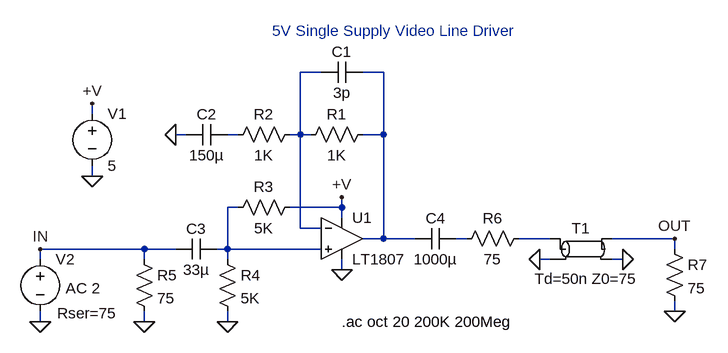
[diagram p0: schematic 1807.asc]
1807.asc, the LTspice schematic file:
Version 4
SHEET 1 896 680
WIRE 160 -16 128 -16
WIRE 256 -16 224 -16
WIRE -192 48 -192 32
WIRE -48 80 -64 80
WIRE 32 80 16 80
WIRE 128 80 128 -16
WIRE 128 80 112 80
WIRE 144 80 128 80
WIRE 256 80 256 -16
WIRE 256 80 224 80
WIRE -192 144 -192 128
WIRE 32 192 16 192
WIRE 192 192 192 176
WIRE 192 192 112 192
WIRE 192 208 192 192
WIRE 128 224 128 80
WIRE 160 224 128 224
WIRE 256 240 256 80
WIRE 256 240 224 240
WIRE 304 240 256 240
WIRE 384 240 368 240
WIRE 512 240 464 240
WIRE 704 240 608 240
WIRE -112 256 -272 256
WIRE -64 256 -112 256
WIRE 16 256 16 192
WIRE 16 256 0 256
WIRE 160 256 16 256
WIRE 704 256 704 240
WIRE -272 272 -272 256
WIRE -112 272 -112 256
WIRE 16 272 16 256
WIRE 512 272 496 272
WIRE 624 272 608 272
WIRE 192 288 192 272
WIRE 704 352 704 336
WIRE -272 368 -272 352
WIRE -112 368 -112 352
WIRE 16 368 16 352
FLAG -192 144 0
FLAG 192 176 +V
FLAG -192 32 +V
FLAG -64 80 0
FLAG 192 288 0
FLAG 16 368 0
FLAG -112 368 0
FLAG 496 272 0
FLAG 624 272 0
FLAG 704 352 0
FLAG -272 368 0
FLAG 704 240 OUT
FLAG -272 256 IN
SYMBOL voltage -192 32 R0
SYMATTR InstName V1
SYMATTR Value 5
SYMBOL res 240 64 R90
WINDOW 0 0 56 VBottom 2
WINDOW 3 32 56 VTop 2
SYMATTR InstName R1
SYMATTR Value 1K
SYMBOL res 128 64 R90
WINDOW 0 0 56 VBottom 2
WINDOW 3 32 56 VTop 2
SYMATTR InstName R2
SYMATTR Value 1K
SYMBOL opamps\\LT1807 192 176 R0
SYMATTR InstName U1
SYMBOL cap 224 -32 R90
WINDOW 0 0 32 VBottom 2
WINDOW 3 32 32 VTop 2
SYMATTR InstName C1
SYMATTR Value 3p
SYMBOL cap 16 64 R90
WINDOW 0 0 32 VBottom 2
WINDOW 3 32 32 VTop 2
SYMATTR InstName C2
SYMATTR Value 150µ
SYMBOL res 128 176 R90
WINDOW 0 0 56 VBottom 2
WINDOW 3 32 56 VTop 2
SYMATTR InstName R3
SYMATTR Value 5K
SYMBOL res 0 256 R0
SYMATTR InstName R4
SYMATTR Value 5K
SYMBOL cap 0 240 R90
WINDOW 0 0 32 VBottom 2
WINDOW 3 32 32 VTop 2
SYMATTR InstName C3
SYMATTR Value 33µ
SYMBOL res -128 256 R0
SYMATTR InstName R5
SYMATTR Value 75
SYMBOL cap 368 224 R90
WINDOW 0 0 32 VBottom 2
WINDOW 3 32 32 VTop 2
SYMATTR InstName C4
SYMATTR Value 1000µ
SYMBOL res 368 256 R270
WINDOW 0 32 56 VTop 2
WINDOW 3 0 56 VBottom 2
SYMATTR InstName R6
SYMATTR Value 75
SYMBOL tline 560 256 R0
WINDOW 3 -71 46 Left 2
SYMATTR Value Td=50n Z0=75
SYMATTR InstName T1
SYMBOL res 688 240 R0
SYMATTR InstName R7
SYMATTR Value 75
SYMBOL voltage -272 256 R0
WINDOW 3 24 104 Invisible 2
WINDOW 123 39 60 Left 2
WINDOW 39 26 99 Left 2
SYMATTR Value ""
SYMATTR Value2 AC 2
SYMATTR SpiceLine Rser=75
SYMATTR InstName V2
TEXT 192 368 Left 2 !.ac oct 20 200K 200Meg
TEXT 272 -64 Bottom 2 ;5V Single Supply Video Line Driver

The netlist it stands for:
* 1807.asc
V1 +V 0 5
R1 N002 N001 1K
R2 N001 N003 1K
XU1 N004 N001 +V 0 N002 LT1807  ; pins In+ In- V+ V- OUT
C1 N002 N001 3p
C2 N003 0 150µ
R3 +V N004 5K
R4 N004 0 5K
C3 N004 IN 33µ
R5 IN 0 75
C4 N005 N002 1000µ
R6 N005 N006 75
T1 N006 0 OUT 0 Td=50n Z0=75
R7 OUT 0 75
V2 IN 0 AC 2 Rser=75
.ac oct 20 200K 200Meg
* 5V Single Supply Video Line Driver
.backanno
.end